# Altium project 430MHz_25W_PA_SC-1322.PrjPcb
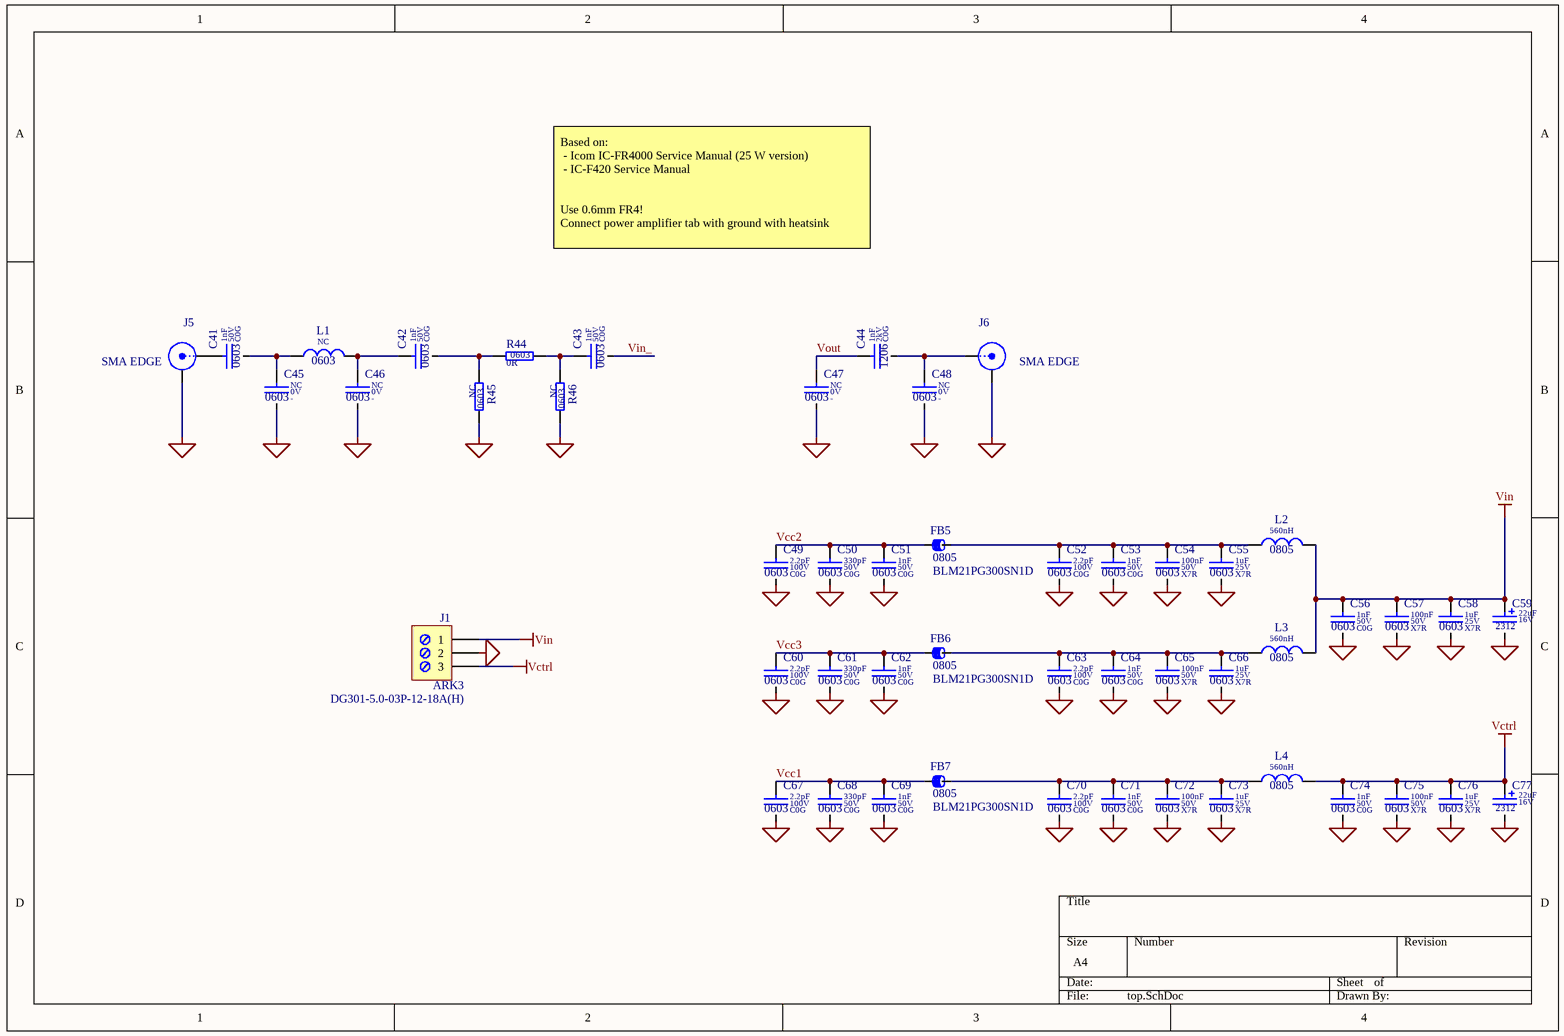
[diagram p0: top.SchDoc]
1 sheet, 50 parts. Net scope: global (net labels, ports and power ports of the same name join across sheets).
Board file: pcb.PcbDoc

## Sheet top.SchDoc
size A4

### Parts
C41  value 1nF  Dielectric: C0G  Voltage: 50V  SCH_Footprint: 0603  [C_0603_1608]  (hidden comment: Ceramic C0G)
C42  value 1nF  Dielectric: C0G  Voltage: 50V  SCH_Footprint: 0603  [C_0603_1608]  (hidden comment: Ceramic C0G)
C43  value 1nF  Dielectric: C0G  Voltage: 50V  SCH_Footprint: 0603  [C_0603_1608]  (hidden comment: Ceramic C0G)
C44  value 1nF  Dielectric: C0G  Voltage: 2kV  SCH_Footprint: 1206  [C_1206_3216]  (hidden comment: Ceramic C0G)
C45  value NC  Voltage: 0V  SCH_Footprint: 0603  [C_NC_0603_1608]  (hidden comment: -)
C46  value NC  Voltage: 0V  SCH_Footprint: 0603  [C_NC_0603_1608]  (hidden comment: -)
C47  value NC  Voltage: 0V  SCH_Footprint: 0603  [C_NC_0603_1608]  (hidden comment: -)
C48  value NC  Voltage: 0V  SCH_Footprint: 0603  [C_NC_0603_1608]  (hidden comment: -)
C49  value 2.2pF  Dielectric: C0G  Voltage: 100V  SCH_Footprint: 0603  [C_0603_1608]  (hidden comment: Ceramic C0G)
C50  value 330pF  Dielectric: C0G  Voltage: 50V  SCH_Footprint: 0603  [C_0603_1608]  (hidden comment: Ceramic C0G)
C51  value 1nF  Dielectric: C0G  Voltage: 50V  SCH_Footprint: 0603  [C_0603_1608]  (hidden comment: Ceramic C0G)
C52  value 2.2pF  Dielectric: C0G  Voltage: 100V  SCH_Footprint: 0603  [C_0603_1608]  (hidden comment: Ceramic C0G)
C53  value 1nF  Dielectric: C0G  Voltage: 50V  SCH_Footprint: 0603  [C_0603_1608]  (hidden comment: Ceramic C0G)
C54  value 100nF  Dielectric: X7R  Voltage: 50V  SCH_Footprint: 0603  [C_0603_1608]  (hidden comment: Ceramic X7R)
C55  value 1uF  Dielectric: X7R  Voltage: 25V  SCH_Footprint: 0603  [C_0603_1608]  (hidden comment: Ceramic X7R)
C56  value 1nF  Dielectric: C0G  Voltage: 50V  SCH_Footprint: 0603  [C_0603_1608]  (hidden comment: Ceramic C0G)
C57  value 100nF  Dielectric: X7R  Voltage: 50V  SCH_Footprint: 0603  [C_0603_1608]  (hidden comment: Ceramic X7R)
C58  value 1uF  Dielectric: X7R  Voltage: 25V  SCH_Footprint: 0603  [C_0603_1608]  (hidden comment: Ceramic X7R)
C59  value 22uF  SCH_Footprint: 2312  Voltage: 16V  [CT_2312_6032]  (hidden comment: Tantalum Capacitor)
C60  value 2.2pF  Dielectric: C0G  Voltage: 100V  SCH_Footprint: 0603  [C_0603_1608]  (hidden comment: Ceramic C0G)
C61  value 330pF  Dielectric: C0G  Voltage: 50V  SCH_Footprint: 0603  [C_0603_1608]  (hidden comment: Ceramic C0G)
C62  value 1nF  Dielectric: C0G  Voltage: 50V  SCH_Footprint: 0603  [C_0603_1608]  (hidden comment: Ceramic C0G)
C63  value 2.2pF  Dielectric: C0G  Voltage: 100V  SCH_Footprint: 0603  [C_0603_1608]  (hidden comment: Ceramic C0G)
C64  value 1nF  Dielectric: C0G  Voltage: 50V  SCH_Footprint: 0603  [C_0603_1608]  (hidden comment: Ceramic C0G)
C65  value 100nF  Dielectric: X7R  Voltage: 50V  SCH_Footprint: 0603  [C_0603_1608]  (hidden comment: Ceramic X7R)
C66  value 1uF  Dielectric: X7R  Voltage: 25V  SCH_Footprint: 0603  [C_0603_1608]  (hidden comment: Ceramic X7R)
C67  value 2.2pF  Dielectric: C0G  Voltage: 100V  SCH_Footprint: 0603  [C_0603_1608]  (hidden comment: Ceramic C0G)
C68  value 330pF  Dielectric: C0G  Voltage: 50V  SCH_Footprint: 0603  [C_0603_1608]  (hidden comment: Ceramic C0G)
C69  value 1nF  Dielectric: C0G  Voltage: 50V  SCH_Footprint: 0603  [C_0603_1608]  (hidden comment: Ceramic C0G)
C70  value 2.2pF  Dielectric: C0G  Voltage: 100V  SCH_Footprint: 0603  [C_0603_1608]  (hidden comment: Ceramic C0G)
C71  value 1nF  Dielectric: C0G  Voltage: 50V  SCH_Footprint: 0603  [C_0603_1608]  (hidden comment: Ceramic C0G)
C72  value 100nF  Dielectric: X7R  Voltage: 50V  SCH_Footprint: 0603  [C_0603_1608]  (hidden comment: Ceramic X7R)
C73  value 1uF  Dielectric: X7R  Voltage: 25V  SCH_Footprint: 0603  [C_0603_1608]  (hidden comment: Ceramic X7R)
C74  value 1nF  Dielectric: C0G  Voltage: 50V  SCH_Footprint: 0603  [C_0603_1608]  (hidden comment: Ceramic C0G)
C75  value 100nF  Dielectric: X7R  Voltage: 50V  SCH_Footprint: 0603  [C_0603_1608]  (hidden comment: Ceramic X7R)
C76  value 1uF  Dielectric: X7R  Voltage: 25V  SCH_Footprint: 0603  [C_0603_1608]  (hidden comment: Ceramic X7R)
C77  value 22uF  SCH_Footprint: 2312  Voltage: 16V  [CT_2312_6032]  (hidden comment: Tantalum Capacitor)
FB5  value BLM21PG300SN1D  SCH_Footprint: 0805  [FB_0805_2012]  (hidden comment: Ferrite bead)
FB6  value BLM21PG300SN1D  SCH_Footprint: 0805  [FB_0805_2012]  (hidden comment: Ferrite bead)
FB7  value BLM21PG300SN1D  SCH_Footprint: 0805  [FB_0805_2012]  (hidden comment: Ferrite bead)
J1  value DG301-5.0-03P-12-18A(H)  [J_ARK3]  (hidden comment: ARK3)
J5  SMA EDGE  [J_SMA_EDGE]
J6  SMA EDGE  [J_SMA_EDGE]
L1  value NC  SCH_Footprint: 0603  [L_NC_0603_1608]
L2  value 560nH  SCH_Footprint: 0805  [L_0805_2012]  (hidden comment: Inductor)
L3  value 560nH  SCH_Footprint: 0805  [L_0805_2012]  (hidden comment: Inductor)
L4  value 560nH  SCH_Footprint: 0805  [L_0805_2012]  (hidden comment: Inductor)
R44  value 0R  SCH_Footprint: 0603  [R_0603_1608]  (hidden comment: Resistor)
R45  value NC  SCH_Footprint: 0603  [R_NC_0603_1608]  (hidden comment: Resistor)
R46  value NC  SCH_Footprint: 0603  [R_NC_0603_1608]  (hidden comment: Resistor)

### Nets
GND: C45.2 C46.2 C47.2 C48.2 C49.2 C50.2 C51.2 C52.2 C53.2 C54.2 C55.2 C56.2 C57.2 C58.2 C59.2 C60.2 C61.2 C62.2 C63.2 C64.2 C65.2 C66.2 C67.2 C68.2 C69.2 C70.2 C71.2 C72.2 C73.2 C74.2 C75.2 C76.2 C77.2 J1.2 J5.2(GND) J6.2(GND) R45.2 R46.2
Vctrl: C74.1 C75.1 C76.1 C77.1 J1.3 L4.2
Vin: C56.1 C57.1 C58.1 C59.1 J1.1 L2.2 L3.2
Vcc1: C67.1 C68.1 C69.1 FB7.1
Vcc2: C49.1 C50.1 C51.1 FB5.1
Vcc3: C60.1 C61.1 C62.1 FB6.1
Vin_: C43.2
Vout: C44.1 C47.1
NetC41_1: C41.1 J5.1(X)
NetC41_2: C41.2 C45.1 L1.1
NetC42_1: C42.1 C46.1 L1.2
NetC42_2: C42.2 R44.1 R45.1
NetC43_1: C43.1 R44.2 R46.1
NetC44_2: C44.2 C48.1 J6.1(X)
NetC52_1: C52.1 C53.1 C54.1 C55.1 FB5.2 L2.1
NetC63_1: C63.1 C64.1 C65.1 C66.1 FB6.2 L3.1
NetC70_1: C70.1 C71.1 C72.1 C73.1 FB7.2 L4.1

### Notes on the sheet
- Based on:
  - Icom IC-FR4000 Service Manual (25 W version)
  - IC-F420 Service Manual
  Use 0.6mm FR4!
  Connect power amplifier tab with ground with heatsink

### Library data of the parts
C41-C43 C51 C53 C56 C62 C64 C69 C71 C74 = C_1nF_50V_C0G_0603_5: Capacitor; Manufacturer: Samsung; Manufacturer Part Number: CL10C102JB8NNNC; Tolerance (%): 5; Part Number: C_1nF_50V_C0G_0603_5; HelpURL: http://www.tme.eu/pl/Document/7da762c1dbaf553c64ad9c40d3603826/mlcc_samsung.pdf; Supplier 1: TME; Supplier Part Number 1: CL10C102JB8NNNC; Supplier 2: RS Components; Supplier 3: Farnell; Supplier 4: Mouser; Supplier 5: Digi-Key
C44 = C_1nF_2kV_C0G_1206_10: Capacitor; Manufacturer: AVX; Manufacturer Part Number: 1206GC102KAT1A; Tolerance (%): 10; Part Number: C_1nF_2kV_C0G_1206_10; HelpURL: http://www.tme.eu/pl/Document/667fe6e7748c0ed1675574c6bf64b751/AVX_X7R.pdf; Supplier 1: TME; Supplier Part Number 1: 1206GC102KAT1A; Supplier 2: RS Components; Supplier 3: Farnell; Supplier 4: Mouser; Supplier 5: Digi-Key
C45-C48 = C_GENERIC_0603: Capacitor; Tolerance (%): 0; Dielectric: -; Part Number: C_GENERIC_0603; HelpURL: http://-; Manufacturer: -; Manufacturer Part Number: -; Supplier 1: TME; Supplier 2: RS Components; Supplier 3: Farnell; Supplier 4: Mouser; Supplier 5: Digi-Key
C49 C52 C60 C63 C67 C70 = C_2.2pF_100V_C0G_0603_5: Capacitor; Manufacturer: AVX; Manufacturer Part Number: 06031A2R2BAT2A; Tolerance (%): 5; Part Number: C_2.2pF_100V_C0G_0603_5; HelpURL: https://datasheet.octopart.com/06031A2R2BAT2A-AVX-datasheet-167032.pdf; Supplier 1: TME; Supplier 2: RS Components; Supplier 3: Farnell; Supplier Part Number 3: 2579012; Supplier 4: Mouser; Supplier Part Number 4: 581-06031A2R2BAT2A; Supplier 5: Digi-Key; Supplier Part Number 5: 478-3686-1-ND
C50 C61 C68 = C_330pF_50V_C0G_0603_5: Capacitor; Manufacturer: Murata; Manufacturer Part Number: GRM1885C1H331JA01D; Tolerance (%): 5; Part Number: C_330pF_50V_C0G_0603_5; HelpURL: http://www.mouser.com/ds/2/281/c02e-2905.pdf; Supplier 1: TME; Supplier Part Number 1: GRM1885C1H331JA01D; Supplier 2: RS Components; Supplier 3: Farnell; Supplier 4: Mouser; Supplier 5: Digi-Key
C54 C57 C65 C72 C75 = C_100nF_50V_X7R_0603_5: Capacitor; Manufacturer: Samsung; Manufacturer Part Number: CL10B104JB8NNNC; Tolerance (%): 5; Part Number: C_100nF_50V_X7R_0603_5; HelpURL: http://www.tme.eu/pl/Document/4a42202b32dab16128fe107dd69598cc/samsung-chip-cap.pdf; Supplier 1: TME; Supplier Part Number 1: CL10B104JB8NNNC; Supplier 2: RS Components; Supplier 3: Farnell; Supplier 4: Mouser; Supplier 5: Digi-Key
C55 C58 C66 C73 C76 = C_1uF_25V_X7R_0603_10: Capacitor; Manufacturer: Samsung; Manufacturer Part Number: CL10B105KA8NNNC; Tolerance (%): 10; Part Number: C_1uF_25V_X7R_0603_10; HelpURL: http://www.tme.eu/pl/Document/4a42202b32dab16128fe107dd69598cc/samsung-chip-cap.pdf; Supplier 1: TME; Supplier Part Number 1: CL10B105KA8NNNC; Supplier 2: RS Components; Supplier 3: Farnell; Supplier 4: Mouser; Supplier 5: Digi-Key
C59 C77 = CT_22uF_16V_TA2O5_2312_10: Capacitor; Manufacturer: Kemet; Manufacturer Part Number: T494C226K016AT; Dielectric: TA2O5; Tolerance (%): 10; Part Number: CT_22uF_16V_TA2O5_2312_10; HelpURL: https://content.kemet.com/datasheets/KEM_T2008_T494.pdf; Supplier 1: TME; Supplier Part Number 1: T494C226K016AT; Supplier 2: RS Components; Supplier Part Number 2: 1726639; Supplier 3: Farnell; Supplier Part Number 3: 2762195; Supplier 4: Mouser; Supplier Part Number 4: 80-T494C226K016; Supplier 5: Digi-Key; Supplier Part Number 5: 399-3845-1-ND
FB5-FB7 = FB_BLM21PG300SN1D: Manufacturer: Murata; Current: 3A; Resistance: 30R; Part Number: FB_BLM21PG300SN1D; HelpURL: http://www.mouser.com/ds/2/281/c31e-794748.pdf; Manufacturer Part Number: BLM21PG300SN1D; Supplier 1: TME; Supplier Part Number 1: BLM21PG300SN1D; Supplier 2: RS Components; Supplier Part Number 2: 7241536; Supplier 3: Farnell; Supplier Part Number 3: 1515662; Supplier 4: Mouser; Supplier Part Number 4: 81-BLM21P300S; Supplier 5: Digi-Key; Supplier Part Number 5: 490-1052-1-ND
J1 = J_TB-5.0-P-3P: ARK Screw terminal, 3-Pin; Manufacturer: DEGSON ELECTRONICS; SCH_Footprint: ARK3; Part Number: J_TB-5.0-P-3P; Component Type: Standard; HelpURL: https://datasheet.octopart.com/DG301-5.0-03P-12-18A%28H%29-Degson-datasheet-17801202.pdf; Manufacturer Part Number: DG301-5.0-03P-12-18A(H); Supplier 1: TME; Supplier Part Number 1: DG301-5.0-3/6B; Supplier 2: RS Components; Supplier 3: Farnell; Supplier 4: Mouser; Supplier 5: Digi-Key
J5 J6 = J_SMA_EDGE_UNIVERSAL: SMA connector; Part Number: J_SMA_EDGE_UNIVERSAL; SCH_Footprint: SMA EDGE; Component Type: Standard; Supplier 1: TME; Supplier 2: RS Components; Supplier 3: Farnell; Supplier 4: Mouser; Supplier 5: Digi-Key
L1 = L_0603: Induction; Part Number: L_0603; Supplier 1: TME; Supplier 2: RS Components; Supplier 3: Farnell; Supplier 4: Mouser; Supplier 5: Digi-Key
L2-L4 = L_560nH_1.7A_0805: Induction; Manufacturer: Wurth; Manufacturer Part Number: 74479974156; Current: 1.7A; Resistance: 100mR; Part Number: L_560nH_1.7A_0805; HelpURL: https://datasheet.octopart.com/74479974156-W%C3%BCrth-Elektronik-datasheet-62333476.pdf; Supplier 1: TME; Supplier 2: RS Components; Supplier Part Number 2: 923-6378; Supplier 3: Farnell; Supplier Part Number 3: 2543275; Supplier 4: Mouser; Supplier Part Number 4: 710-74479974156; Supplier 5: Digi-Key; Supplier Part Number 5: 732-9693-1-ND
R44 = R_0R_0603_5: Manufacturer: Samsung; Manufacturer Part Number: RC1608J000CS; Voltage: 50V; Power: 100mW; Tolerance: 5%; Part Number: R_0R_0603_5; HelpURL: http://www.samsungsem.com/kr/support/product-search/chip-resistor/RC1608J000CS.jsp; Supplier 1: TME; Supplier 2: RS Components; Supplier 3: Farnell; Supplier 4: Mouser; Supplier 5: Digi-Key; Supplier Part Number 5: 1276-3510-1-ND
R45 R46 = R_GENERIC_0603: Part Number: R_GENERIC_0603; Supplier 1: TME; Supplier 2: RS Components; Supplier 3: Farnell; Supplier 4: Mouser; Supplier 5: Digi-Key